# EAGLE design esp-sme (EAGLE 8.7.0)
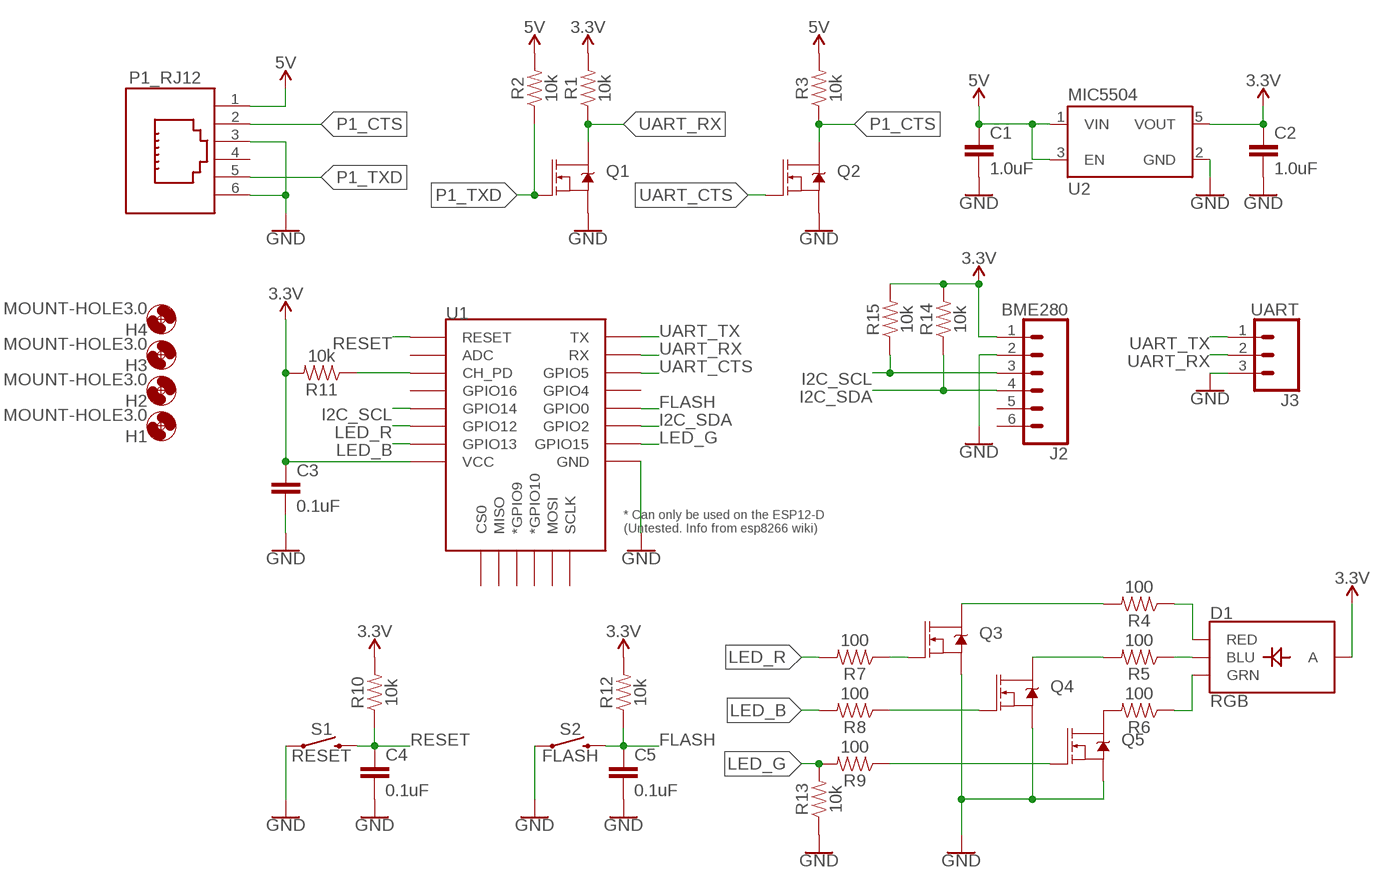
[diagram p0: schematic, sheet 1]

## Parts
C1  1.0uF  1.0UF-0603-16V-10%  [0603]
C2  1.0uF  1.0UF-0603-16V-10%  [0603]
C3  0.1uF  0.1UF-0603-25V-5%  [0603]
C4  0.1uF  0.1UF-0603-25V-5%  [0603]
C5  0.1uF  0.1UF-0603-25V-5%  [0603]
D1  RGB  LED-RGB-CAPLCC  [P-LCC-4-3]
H1  MOUNT-HOLE3.0  [3,0]
H2  MOUNT-HOLE3.0  [3,0]
H3  MOUNT-HOLE3.0  [3,0]
H4  MOUNT-HOLE3.0  [3,0]
J2  BME280  CONN_06SILK_FEMALE_PTH  [1X06]
J3  UART  CONN_03  [1X03]
P1_RJ12  615006143621  [615006143621]
Q1  MOSFET-NCH-AO3404A  [SOT23-3]
Q2  MOSFET-NCH-AO3404A  [SOT23-3]
Q3  MOSFET-NCH-AO3404A  [SOT23-3]
Q4  MOSFET-NCH-AO3404A  [SOT23-3]
Q5  MOSFET-NCH-AO3404A  [SOT23-3]
R1  10k  10KOHM-0603-1/10W-1%  [0603]
R2  10k  10KOHM-0603-1/10W-1%  [0603]
R3  10k  10KOHM-0603-1/10W-1%  [0603]
R4  100  100OHM-0603-1/10W-1%  [0603]
R5  100  100OHM-0603-1/10W-1%  [0603]
R6  100  100OHM-0603-1/10W-1%  [0603]
R7  100  100OHM-0603-1/10W-1%  [0603]
R8  100  100OHM-0603-1/10W-1%  [0603]
R9  100  100OHM-0603-1/10W-1%  [0603]
R10  10k  10KOHM-0603-1/10W-1%  [0603]
R11  10k  10KOHM-0603-1/10W-1%  [0603]
R12  10k  10KOHM-0603-1/10W-1%  [0603]
R13  10k  10KOHM-0603-1/10W-1%  [0603]
R14  10k  10KOHM-0603-1/10W-1%  [0603]
R15  10k  10KOHM-0603-1/10W-1%  [0603]
S1  RESET  MOMENTARY-SWITCH-SPST-SMD-4.6X2.8MM  [TACTILE_SWITCH_SMD_4.6X2.8MM]
S2  FLASH  MOMENTARY-SWITCH-SPST-SMD-4.6X2.8MM  [TACTILE_SWITCH_SMD_4.6X2.8MM]
U1  ESP12ESMD  [ESP12E-SMD]
U2  MIC5504  [SOT23-5]

## Nets
3.3V: C2.1 C3.1 D1.4(A) J2.1 R1.2 R10.2 R11.2 R12.2 R14.2 R15.2 U1.VCC U2.5(VOUT)
5V: C1.1 P1_RJ12.1 R2.2 R3.2 U2.1(VIN) U2.3(EN)
FLASH: C5.1 R12.1 S2.3 S2.4 U1.GPIO0
GND: C1.2 C2.2 C3.2 C4.2 C5.2 J2.2 J3.3 P1_RJ12.3 P1_RJ12.6 Q1.2(S) Q2.2(S) Q3.2(S) Q4.2(S) Q5.2(S) R13.1 S1.1 S1.2 S2.1 S2.2 U1.GND U2.2(GND)
I2C_SCL: J2.3 R15.1 U1.GPIO14
I2C_SDA: J2.4 R14.1 U1.GPIO2
LED_B: R8.2 U1.GPIO13
LED_G: R9.2 R13.2 U1.GPIO15
LED_R: R7.2 U1.GPIO12
N$1: D1.3(BLU) R5.1
N$2: D1.1(RED) R4.1
N$3: D1.2(GRN) R6.1
N$4: Q5.3(D) R6.2
N$5: Q4.3(D) R5.2
N$6: Q3.3(D) R4.2
N$7: Q5.1(G) R9.1
N$8: Q4.1(G) R8.1
N$9: Q3.1(G) R7.1
N$11: R11.1 U1.CH_PD
P1_CTS: P1_RJ12.2 Q2.3(D) R3.1
P1_TXD: P1_RJ12.5 Q1.1(G) R2.1
RESET: C4.1 R10.1 S1.3 S1.4 U1.RESET
UART_CTS: Q2.1(G) U1.GPIO5
UART_RX: J3.2 Q1.3(D) R1.1 U1.RXD0(RX)
UART_TX: J3.1 U1.TXD0(TX)
Unconnected: J2.5 J2.6 P1_RJ12.4 U1.ADC U1.CS0 U1.GPIO4 U1.GPIO9(*GPIO9) U1.GPIO10(*GPIO10) U1.GPIO16 U1.MISO U1.MOSI U1.SCLK

## Library data of the parts
C1 C2 = SparkFun-Capacitors:1.0UF: 1µF ceramic capacitors A capacitor is a passive two-terminal electrical component used to store electrical energy temporarily in an electric field.; PROD_ID: CAP-00868
C3-C5 = SparkFun-Capacitors:0.1UF: 0.1µF ceramic capacitors A capacitor is a passive two-terminal electrical component used to store electrical energy temporarily in an electric field.; PROD_ID: CAP-08604
D1 = SparkFun-LED:LED-RGB-CA: LED-RGB Diffused Common Anode Packages: LED RGB-THRU P-LCC-4-3 LED-TRICOLOR-SMD SparkFun Products: RGB Diffused Common Anode- Diffuse <[https://www.sparkfun.com/products/10821]> RGB Diffused Common Anode - Clear <[https://www.sparkfun.com/products/10820]> Qduino Mini <[https://www.sparkfun.com/products/13614]> Triple Output LED RGB - SMD <https://www.sparkfun.com/products/7844>; PROD_ID: DIO-12986
H1-H4 = holes:MOUNT-HOLE: MOUNTING HOLE with drill center marker
J2 = SparkFun-Connectors:CONN_06: Multi connection point. Often used as Generic Header-pin footprint for 0.1 inch spaced/style header connections On any of the 0.1 inch spaced packages, you can populate with these: Break Away Headers - Straight <https://www.sparkfun.com/products/116> (PRT-00116) Break Away Male Headers - Right Angle <https://www.sparkfun.com/products/553> (PRT-00553) Female Headers <https://www.sparkfun.com/products/115> (PRT-00115) Break Away Headers - Machine Pin <https://www.sparkfun.com/products/117> (PRT-00117) Break Away Female Headers - Swiss Machine Pin <https://www.sparkfun.com/products/743> (PRT-00743) Arduino Stackable Header - 6 Pin <https://www.sparkfun.com/products/9280> (PRT-09280) For SCREWTERMINALS and SPRING TERMINALS visit here: Screw Terimnals on SparkFun.com <https://www.sparkfun.com/search/results?term=Screw+Terminals> (5mm/3.5mm/2.54mm spacing) This device is also useful as a general connection point to wire up your design to another part of your project. Our various solder wires solder well into these plated through hole pads. Hook-Up Wire - Assortment (Stranded, 22 AWG) <https://www.sparkfun.com/products/11375> (PRT-11375) Hook-Up Wire - Assortment (Solid Core, 22 AWG) <https://www.sparkfun.com/products/11367> (PRT-11367) View the entire wire category on our website here <https://www.sparkfun.com/categories/141>; PROD_ID: CONN-08437
J3 = SparkFun-Connectors:CONN_03: Multi connection point. Often used as Generic Header-pin footprint for 0.1 inch spaced/style header connections On any of the 0.1 inch spaced packages, you can populate with these: Break Away Headers - Straight <https://www.sparkfun.com/products/116> (PRT-00116) Break Away Male Headers - Right Angle <https://www.sparkfun.com/products/553> (PRT-00553) Female Headers <https://www.sparkfun.com/products/115> (PRT-00115) Break Away Headers - Machine Pin <https://www.sparkfun.com/products/117> (PRT-00117) Break Away Female Headers - Swiss Machine Pin <https://www.sparkfun.com/products/743> (PRT-00743) Stackable Header - 3 Pin (Female, 0.1") <https://www.sparkfun.com/products/13875> (PRT-13875) For SCREWTERMINALS and SPRING TERMINALS visit here: Screw Terimnals on SparkFun.com <https://www.sparkfun.com/search/results?term=Screw+Terminals> (5mm/3.5mm/2.54mm spacing) This device is also useful as a general connection point to wire up your design to another part of your project. Our various solder wires solder well into these plated through hole pads. Hook-Up Wire - Assortment (Stranded, 22 AWG) <https://www.sparkfun.com/products/11375> (PRT-11375) Hook-Up Wire - Assortment (Solid Core, 22 AWG) <https://www.sparkfun.com/products/11367> (PRT-11367) View the entire wire category on our website here <https://www.sparkfun.com/categories/141> Special notes: Molex polarized connector foot print use with SKU : PRT-08232 with associated crimp pins and housings.
P1_RJ12 = InputOutputIO (rev18a):615006143621: WR-MJ Horizontal Plastic 6P6C Modular Jack Tab Down, 6 Pins=>Code : Con_I-O_MJ-H_Plastic_Down_615006143621 <http://katalog.we-online.de/media/images/eican/Con_I-O_MJ-H_Plastic_Down_615006143621_pf2.jpg> Details see: http://katalog.we-online.de/en/em/MJ_HORIZONTAL_PLASTIC_6P6C_TAB_DOWN Created 2014-07-10, Karrer Zheng 2014 (C) Würth Elektronik
Q1-Q5 = SparkFun-DiscreteSemi:MOSFET-NCH: N-channel MOSFETs Voltage controlled devices that allow control of high current outputs. SparkFun Products: SparkFun OpenScale <https://www.sparkfun.com/products/13261> SparkFun Digital Sandbox <https://www.sparkfun.com/products/12651> SparkFun Monster Moto Shield <https://www.sparkfun.com/products/10182> SparkFun MOSFET Power Controller <https://www.sparkfun.com/products/11214>; PROD_ID: TRANS-12988; VALUE: 5.8A/30V/35mΩ
R1-R3 R10-R15 = SparkFun-Resistors:10KOHM: 10kΩ resistor A resistor is a passive two-terminal electrical component that implements electrical resistance as a circuit element. Resistors act to reduce current flow, and, at the same time, act to lower voltage levels within circuits. - Wikipedia; PROD_ID: RES-00824
R4-R9 = SparkFun-Resistors:100OHM: 100Ω resistor A resistor is a passive two-terminal electrical component that implements electrical resistance as a circuit element. Resistors act to reduce current flow, and, at the same time, act to lower voltage levels within circuits. - Wikipedia; PROD_ID: RES-07863
S1 S2 = SparkFun-Switches:MOMENTARY-SWITCH-SPST: Momentary Switch (Pushbutton) - SPST Normally-open (NO) SPST momentary switches (buttons, pushbuttons). Variants PTH-12MM - 12mm square, through-hole Momentary Pushbutton Switch - 12mm Square <https://www.sparkfun.com/products/9190> (COM-09190) PTH-6.0MM, PTH-6.0MM-KIT - 6.0mm square, through-hole Mini Pushbutton Switch <https://www.sparkfun.com/products/97> (COM-00097) KIT package intended for soldering kit's - only one side of pads' copper is exposed. PTH-RIGHT-ANGLE-KIT - Right-angle, through-hole Right Angle Tactile Button <https://www.sparkfun.com/products/10791> - Used on SparkFun BigTime Watch Kit <https://www.sparkfun.com/products/11734> SMD-12MM - 12mm square, surface-mount Tactile Button - SMD (12mm) <https://www.sparkfun.com/products/12993> (COM-12993) Used on SparkFun PicoBoard <https://www.sparkfun.com/products/11888> SMD-4.5MM - 4.5mm Square Trackball Switch Used on SparkFun Blackberry Trackballer Breakout <https://www.sparkfun.com/products/13169> SMD-4.6MMX2.8MM - 4.60mm x 2.80mm, surface mount Used on SparkFun SAMD21 Mini Breakout <https://www.sparkfun.com/products/13664> SMD-5.2MM, SMD-5.2-REDUNDANT - 5.2mm square, surface-mount Mini Pushbutton Switch - SMD <https://www.sparkfun.com/products/8720> (COM-08720) Used on Arduino Pro Mini <https://www.sparkfun.com/products/11114> REDUNDANT package connects both switch circuits together SMD-6.0X3.5MM - 6.0 x 3.5mm, surface mount Momentary Reset Switch SMD <https://www.sparkfun.com/products/8229> (COM-08229) SMD-6.2MM-TALL - 6.2mm square, surface mount Tactile Button - SMD (6mm) <https://www.sparkfun.com/products/12992> Used on SparkFun Digital Sandbox <https://www.sparkfun.com/products/12651> SMD-RIGHT-ANGLE - Right-angle, surface mount Used on SparkFun Block for Intel® Edison - Arduino <https://www.sparkfun.com/products/13036>; PROD_ID: SWCH-13065
U1 = esp8266modules:ESP12E: ESP12E Module
U2 = misc:MIC5504

## Board
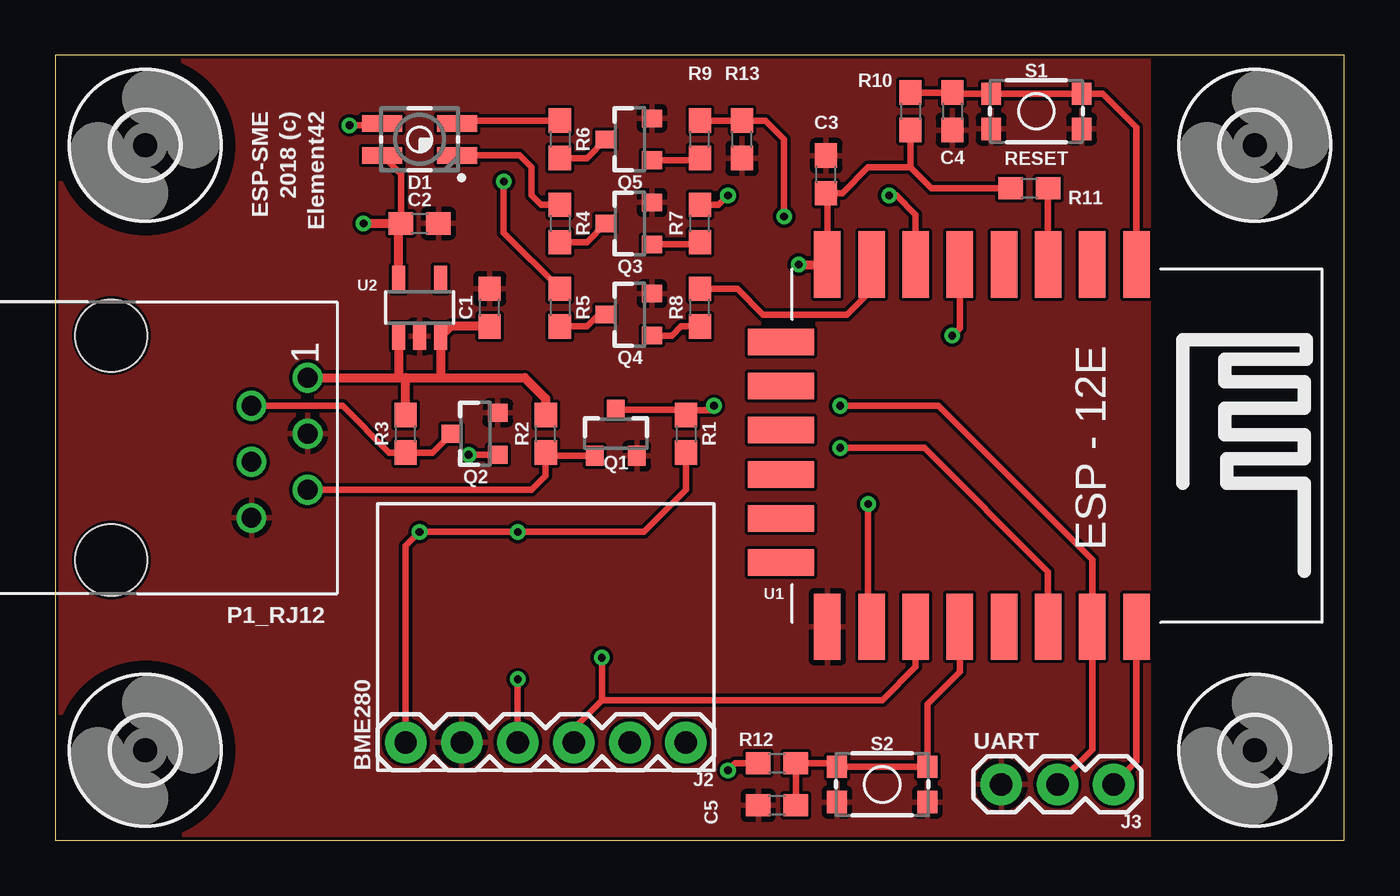
[diagram p1: board, top side]
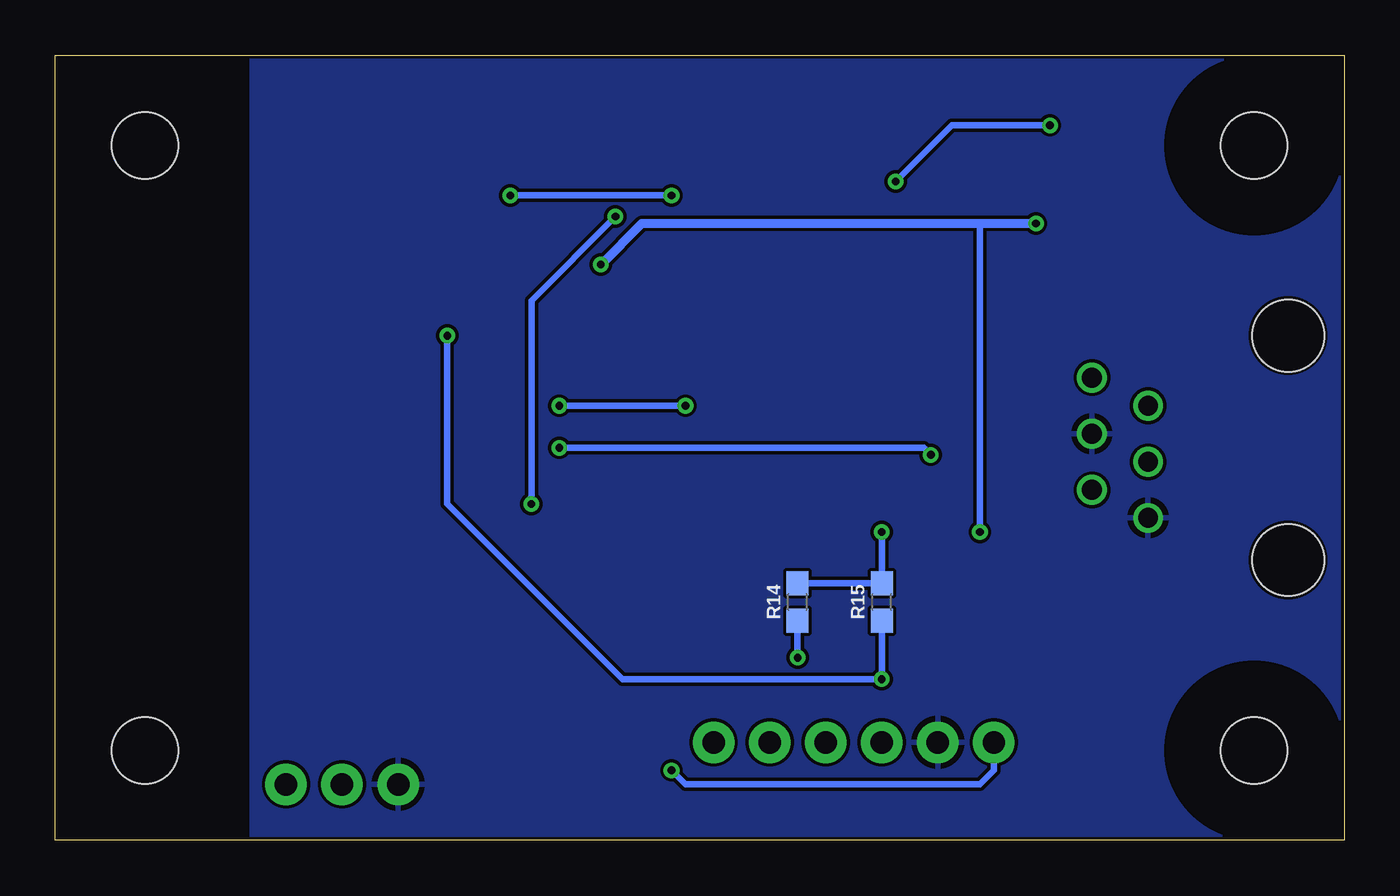
[diagram p2: board, bottom side, seen from below]

Size 58.4 x 35.56 mm. Coordinates in mm from the lower left corner, seen from the top.
Outline: 0,0 58.4,0 58.4,35.56 0,35.56 0,0
Copper layers (1*16): Top 0.035mm / dielectric 1.5mm / Bottom 0.035mm
Design rules "SparkFun-2-layer-PCBWay-LIMIT": minimum track width 6mil, minimum drill 0.3mm, track to track 6mil, track to pad 6mil, pad to pad 6mil, via to via 6mil, smd to smd 6mil, copper to edge 6mil, drill to drill 6mil, minimum pad ring 7mil, minimum via ring 7mil, stop-mask expansion 4mil, vias tented up to drill 25mil, thermal gap 10mil

### Footprints (pad centres in the part's own frame; a part is rotated, then mirrored left to right if it is on the bottom)
0603 = smd 1.1 x 1: 1 -0.85,0; 2 0.85,0
P-LCC-4-3 = smd 1.8 x 0.75: 1 -1.7,0.725; 2 -1.7,-0.725; 3 1.7,-0.725; 4 1.7,0.725
3,0 = hole 3: 0,0
1X06 = drill 1.016 pad 1.88: 1 0,0; 2 2.54,0; 3 5.08,0; 4 7.62,0; 5 10.16,0; 6 12.7,0
1X03 = drill 1.016 pad 1.88: 1 0,0; 2 2.54,0; 3 5.08,0
615006143621 = drill 0.9: 1 -3.175,8.89; 2 -1.905,6.35; 3 -0.635,8.89; 4 0.635,6.35; 5 1.905,8.89; 6 3.175,6.35 | hole 3.25: -5.08,0; 5.08,0
SOT23-3 = smd 0.8 x 0.9: 1 -0.95,-1; 2 0.95,-1; 3 0,1.1
TACTILE_SWITCH_SMD_4.6X2.8MM = smd 0.9 x 1: 1 -2.05,-0.8; 2 2.05,-0.8; 3 2.05,0.8; 4 -2.05,0.8
ESP12E-SMD = smd 3 x 1.2: ADC -8.3,3.8; CH_PD -8.3,1.8; GND 8.1,-8.2; GPIO0 8.1,-2.2; GPIO2 8.1,-4.2; GPIO4 8.1,-0.2; GPIO5 8.1,1.8; GPIO12 -8.3,-4.2; GPIO13 -8.3,-6.2; GPIO14 -8.3,-2.2; GPIO15 8.1,-6.2; GPIO16 -8.3,-0.2; RESET -8.3,5.8; RXD0 8.1,3.8; TXD0 8.1,5.8; VCC -8.3,-8.2 | smd 1.2 x 3: CS0 -4.8,-10.3; GPIO9 -0.8,-10.3; GPIO10 1.2,-10.3; MISO -2.8,-10.3; MOSI 3.2,-10.3; SCLK 5.2,-10.3
SOT23-5 = smd 0.6 x 1.2: 1 -0.95,-1.306; 2 0,-1.306; 3 0.95,-1.306; 4 0.95,1.306; 5 -0.95,1.306

### Placement (x,y rotation side)
C1  19.68,24.13 90 top
C2  16.51,27.94 0 top
C3  34.92,30.16 90 top
C4  40.64,33.02 270 top
C5  32.7,1.59 180 top
D1  16.51,31.75 180 top
H1  4.08,4.08 0 top
H2  4.08,31.48 0 top
H3  54.34,4.08 0 top
H4  54.34,31.48 0 top
J2  15.88,4.45 0 top
J3  47.94,2.54 180 top
P1_RJ12  2.54,17.78 270 top
Q1  25.4,18.41 0 top
Q2  19.05,18.41 90 top
Q3  26.04,27.94 90 top
Q4  26.04,23.81 90 top
Q5  26.04,31.75 90 top
R1  28.57,18.41 270 top
R2  22.23,18.41 90 top
R3  15.88,18.41 90 top
R4  22.86,27.94 270 top
R5  22.86,24.13 270 top
R6  22.86,31.75 270 top
R7  29.21,27.94 90 top
R8  29.21,24.13 90 top
R9  29.21,31.75 90 top
R10  38.73,33.02 270 top
R11  44.13,29.53 180 top
R12  32.7,3.49 180 top
R13  31.11,31.75 90 top
R14  24.77,10.79 90 bottom
R15  20.95,10.79 90 bottom
S1  44.45,33.02 0 top
S2  37.47,2.54 0 top
U1  43.18,17.78 270 top
U2  16.51,24.13 0 top

### Tracks (layer width: path | path; a pad name or v marks a point on that pad's centre or on a via)
3.3V  (via drill 0.35)
  Top 0.305: C2.1 15.66,30.18 D1.4 | J2.1 15.88,13.33 v16.51,13.97 v20.95,13.97 26.67,13.97 28.57,15.88 R1.2 | U1.VCC 34.98,29.26 C3.1 35.66,29.31 36.83,30.48 38.73,30.48 | R11.2 39.69,29.53 38.73,30.48 | 38.73,30.48 R10.2 | R12.2 30.8,3.49 v30.48,3.17
  Top 0.406: U2.5 15.56,27.84 | 15.56,27.84 C2.1 | v33.68,26.08 | v13.97,27.94 15.46,27.94 15.56,27.84 | v33.68,26.08 U1.VCC | U1.VCC
  Bottom 0.305: v16.51,13.97 16.51,27.94 | R14.2 R15.2 v20.95,13.97 | v30.48,3.17 29.84,2.54 16.51,2.54 15.88,3.17 J2.1
  Bottom 0.406: v33.68,26.08 31.82,27.94 16.51,27.94 v13.97,27.94
5V
  Top 0.406: C1.1 17.92,23.28 U2.3 17.46,20.95 | P1_RJ12.1 15.56,20.95 | 15.56,20.95 15.88,20.95 | U2.1 15.56,20.95 | R3.2 15.88,20.95 | R2.2 22.23,20 21.27,20.95 17.46,20.95 | 15.88,20.95 17.46,20.95
FLASH
  Top 0.305: C5.1 R12.1 35.26,3.49 S2.4 S2.3 39.52,6.18 40.98,7.64 U1.GPIO0
GND
  pour Top: 0,0 0,35.56 49.53,35.56 49.53,0
  pour Bottom: 0,35.56 49.53,35.56 49.53,0 0,0
I2C_SCL  (via drill 0.35)
  Top 0.305: U1.GPIO14 40.98,23.2 v40.64,22.86 | v20.95,7.3 J2.3
  Bottom 0.305: v40.64,22.86 40.64,15.24 32.7,7.3 v20.95,7.3 R15.1
I2C_SDA  (via drill 0.35)
  Top 0.305: 23.5,5.08 24.77,6.35 | 24.77,6.35 37.47,6.35 38.98,7.87 U1.GPIO2 | 24.77,6.35 v24.77,8.28
  Top 0.406: J2.4 23.5,5.08
  Bottom 0.305: v24.77,8.28 R14.1
LED_B
  Top 0.305: R8.2 30.9,24.98 32.07,23.81 35.88,23.81 36.98,24.91
  Top 0.406: 36.98,24.91 U1.GPIO13
LED_G  (via drill 0.35)
  Top 0.305: v36.83,15.24 36.83,9.83 U1.GPIO15 | R9.2 R13.2 32.17,32.6 33.02,31.75 v33.02,28.26
  Bottom 0.305: v33.02,28.26 36.83,24.45 v36.83,15.24
LED_R  (via drill 0.35)
  Top 0.305: U1.GPIO12 38.98,28.33 38.1,29.21 v37.78,29.21 | v30.48,29.21 30.06,28.79 R7.2
  Bottom 0.305: v37.78,29.21 v30.48,29.21
N$1  (via drill 0.35)
  Top 0.254: 14.72,32.38 D1.3
  Top 0.305: v13.34,32.38 14.72,32.38 | R5.1 20.32,27.52 v20.32,29.84
  Bottom 0.305: v20.32,29.84 17.78,32.38 v13.34,32.38
N$2
  Top 0.305: D1.1 21.05,31.02 21.59,30.48 21.59,29.21 22.01,28.79 R4.1
N$3
  Top 0.305: 18.34,32.6 R6.1
  Top 0.406: D1.2 18.34,32.6
N$4
  Top 0.305: R6.2 24.09,30.9 Q5.3
N$5
  Top 0.305: R5.2 24.09,23.28 24.62,23.81 Q4.3
N$6
  Top 0.305: R4.2 24.09,27.09 Q3.3
N$7
  Top 0.305: Q5.1 29.11,30.8
  Top 0.406: 29.11,30.8 R9.1
N$8
  Top 0.305: R8.1 28.36,23.28 27.94,22.86 Q4.1
  Top 0.406: 29.11,23.18 R8.1
N$9
  Top 0.305: Q3.1 29.11,26.99
  Top 0.406: 29.11,26.99 R7.1
N$11
  Top 0.305: U1.CH_PD R11.1
P1_CTS
  Top 0.305: P1_RJ12.2 13.02,19.68 15.14,17.57 R3.1 17.1,17.57 Q2.3
P1_TXD
  Top 0.305: Q1.1 22.38,17.41 R2.1 22.23,16.51 21.59,15.88 P1_RJ12.5
RESET
  Top 0.305: U1.RESET 48.98,32.3 47.46,33.82 S1.3 S1.4 40.69,33.82 C4.1 R10.1
UART_CTS  (via drill 0.35)
  Top 0.305: U1.GPIO5 44.98,12.17 39.37,17.78 v35.56,17.78 | v18.73,17.46 Q2.1
  Bottom 0.305: v35.56,17.78 19.05,17.78 v18.73,17.46
UART_RX  (via drill 0.35)
  Top 0.305: R1.1 28.36,19.47 | 28.36,19.47 28.32,19.52 Q1.3 | v35.56,19.68 40.01,19.68 46.98,12.71 U1.RXD0 46.98,4.12 J3.2 | v29.84,19.68 29.64,19.47 28.36,19.47
  Bottom 0.305: v35.56,19.68 v29.84,19.68
UART_TX
  Top 0.305: U1.TXD0 48.98,3.58 J3.1

### Text on the board
tPlace: ESP-SME | 2018 (c) | Element42